# Altium project rev1-env.PrjPcb
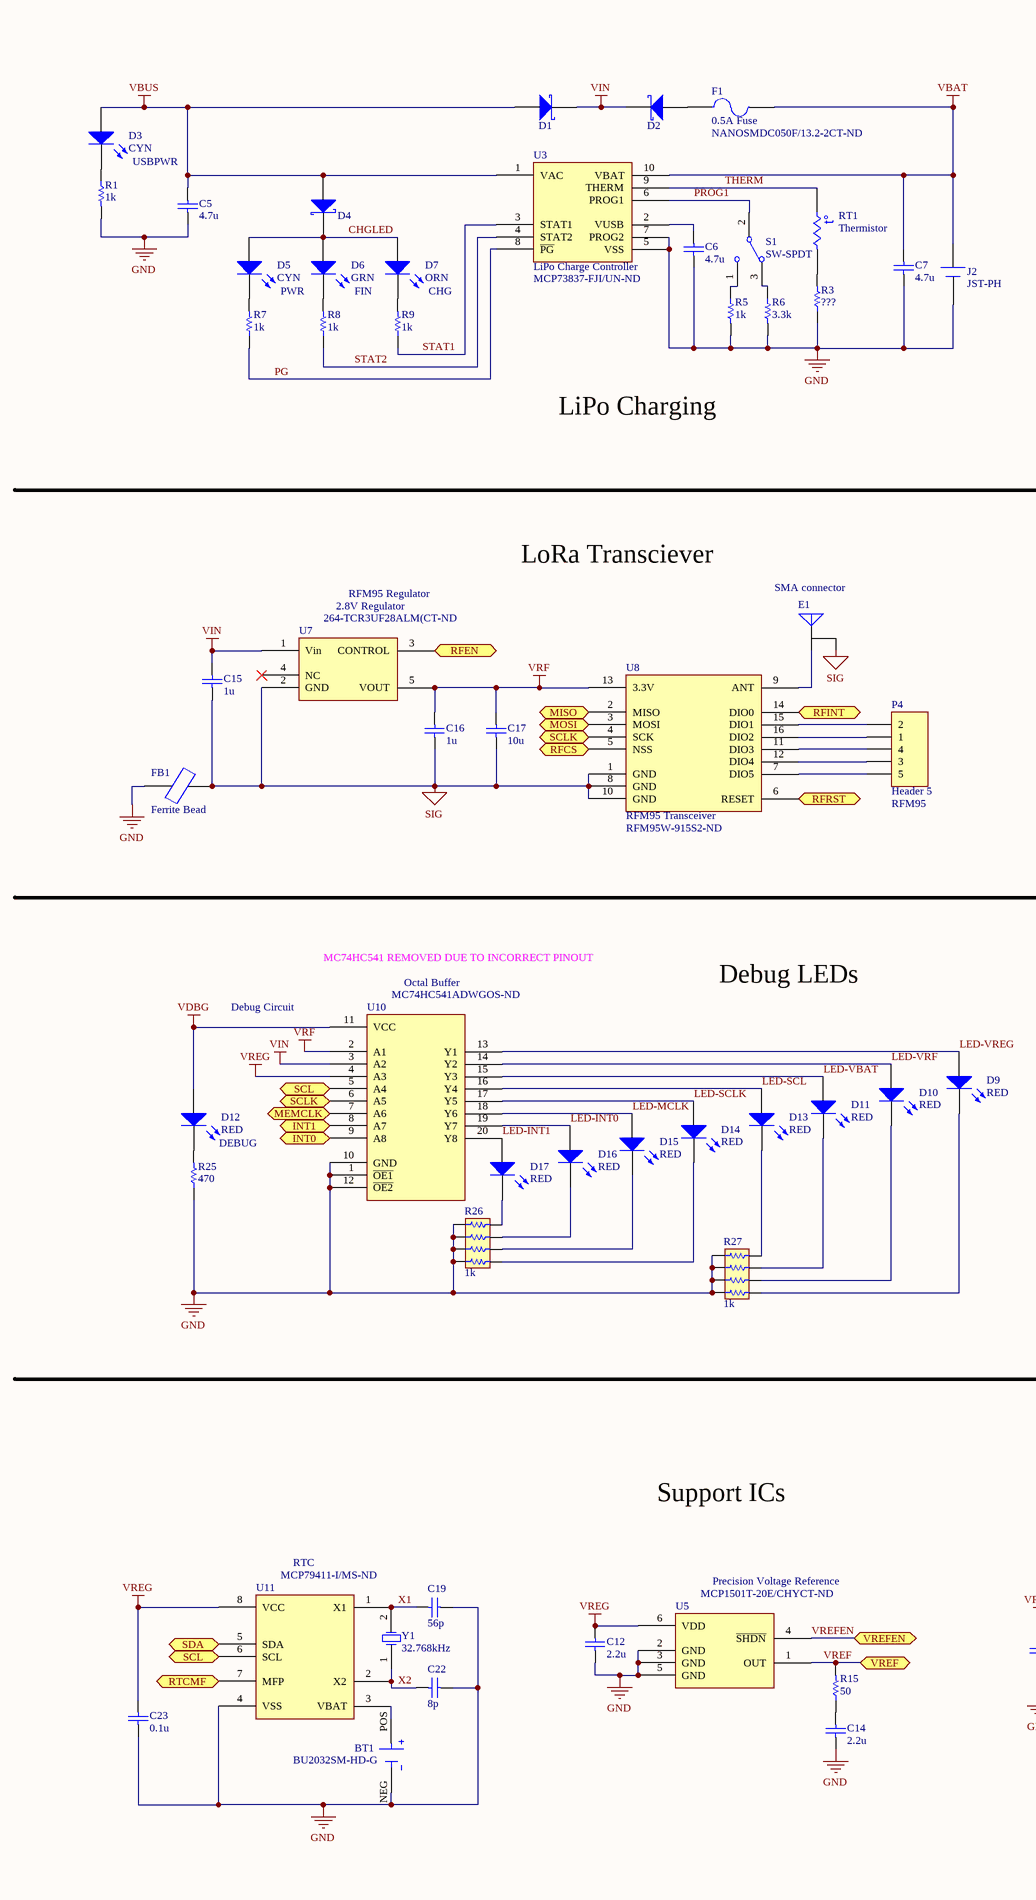
[diagram p0: sch-rev1-env.SchDoc, left]
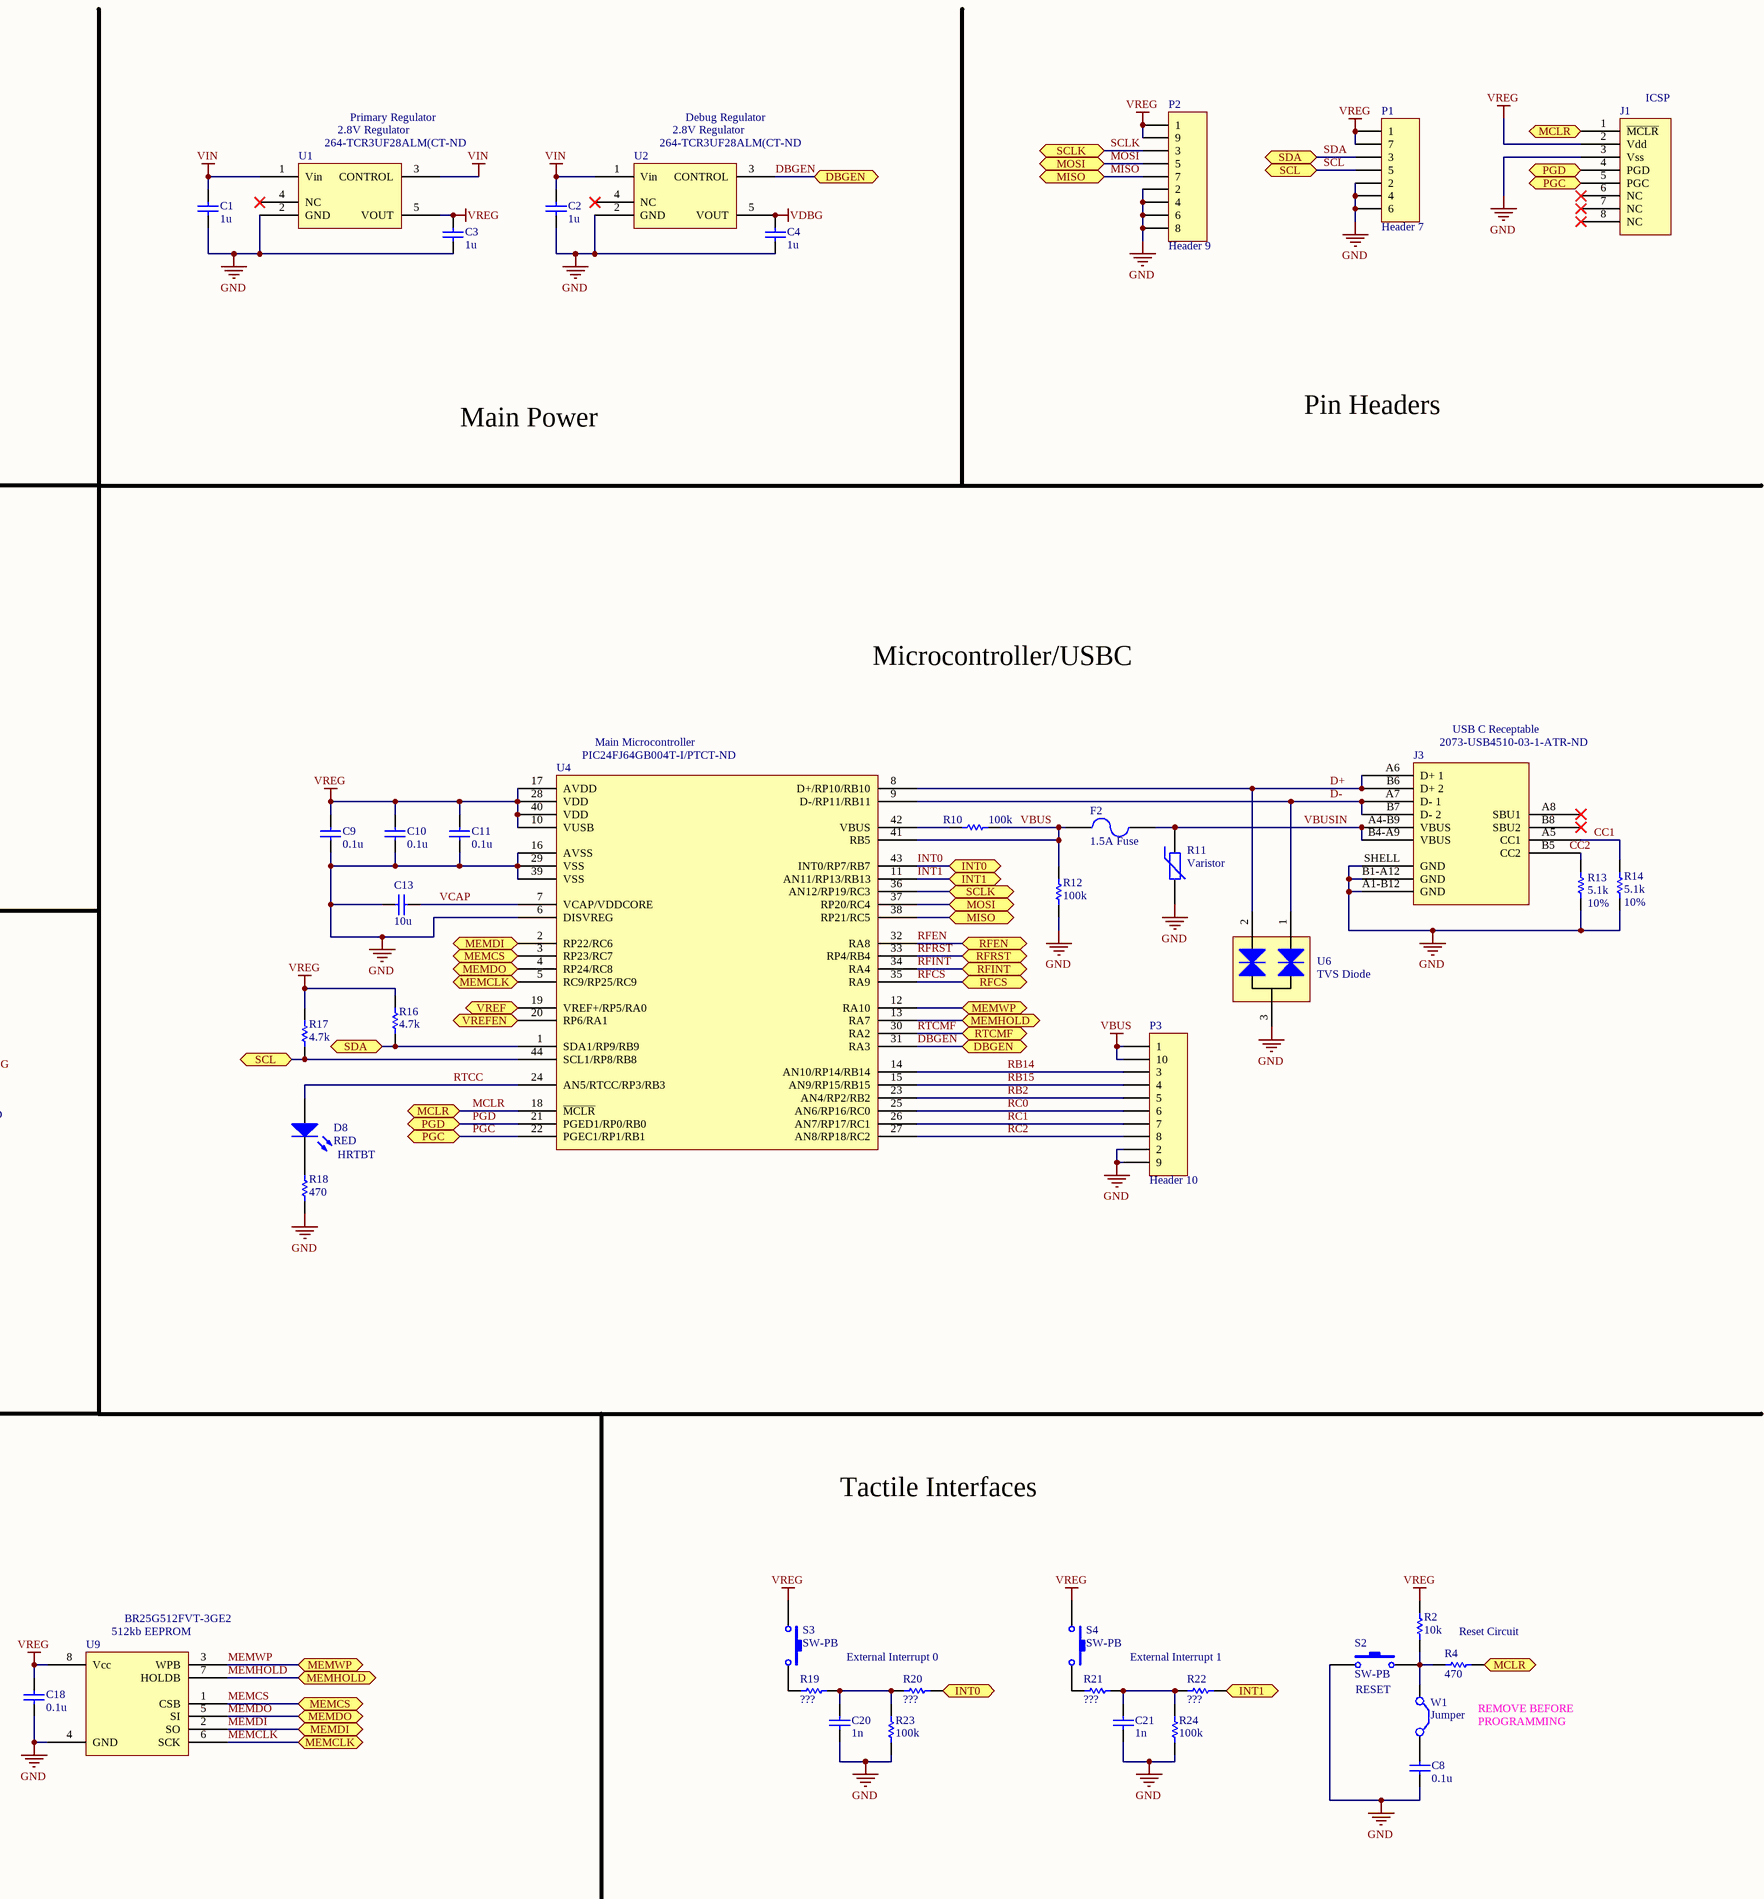
[diagram p1: sch-rev1-env.SchDoc, right]
4 sheets, 97 parts. Net scope: flat (ports and power ports of the same name join across sheets).
Board file: pcb-rev1-env.PcbDoc
Sheets:
  sch-rev1-env.SchDoc
  blockd2-rev1-env.SchDoc
  stated-rev1-env.SchDoc
  blockd-rev1-env.SchDoc

## Sheet sch-rev1-env.SchDoc: Sensor Backplane
size A2; Author: Edward Kneller; DrawnBy: Edward Kneller; Revision: rev01; SheetNumber: 1; SheetTotal: 4

### Parts
BT1  BU2032SM-HD-G  [BAT_BU2032SM-HD-G]
C1  value 1u  [0805]  (hidden comment: Cap)
C2  value 1u  [0805]  (hidden comment: Cap)
C3  value 1u  [0805]  (hidden comment: Cap)
C4  value 1u  [0805]  (hidden comment: Cap)
C5  value 4.7u  [0805]  (hidden comment: Cap)
C6  value 4.7u  [0805]  (hidden comment: Cap)
C7  value 4.7u  [0805]  (hidden comment: Cap)
C8  value 0.1u  [0805]  (hidden comment: Cap)
C9  value 0.1u  [0805]  (hidden comment: Cap)
C10  value 0.1u  [0805]  (hidden comment: Cap)
C11  value 0.1u  [0805]  (hidden comment: Cap)
C12  value 2.2u  [0805]  (hidden comment: Cap)
C13  value 10u  [0805]  (hidden comment: Cap)
C14  value 2.2u  [0805]  (hidden comment: Cap)
C15  value 1u  [0805]  (hidden comment: Cap)
C16  value 1u  [0805]  (hidden comment: Cap)
C17  value 10u  [0805]  (hidden comment: Cap)
C18  value 0.1u  [0805]  (hidden comment: Cap)
C19  value 56p  [0805]  (hidden comment: Cap)
C20  value 1n  [0805]  (hidden comment: Cap)
C21  value 1n  [0805]  (hidden comment: Cap)
C22  value 8p  [0805]  (hidden comment: Cap)
C23  value 0.1u  [0805]  (hidden comment: Cap)
D1  Schottky Diode  [DIODE SOD323]  (value not drawn)
D2  Schottky Diode  [DIODE SOD323]  (value not drawn)
D3  CYN  [LED PLCC2]
D4  Schottky Diode  [DIODE SOD323]  (value not drawn)
D5  CYN  [LED PLCC2]
D6  GRN  [LED PLCC2]
D7  ORN  [LED PLCC2]
D8  RED  [LED PLCC2]
D9  RED  [LED PLCC2]
D10  RED  [LED PLCC2]
D11  RED  [LED PLCC2]
D12  RED  [LED PLCC2]
D13  RED  [LED PLCC2]
D14  RED  [LED PLCC2]
D15  RED  [LED PLCC2]
D16  RED  [LED PLCC2]
D17  RED  [LED PLCC2]
E1  SMA connector  [SMA]
F1  0.5A Fuse  Supplier Part Number 1: NANOSMDC050F/13.2-2CT-ND  [1206]
F2  1.5A Fuse  [1206]
FB1  Ferrite Bead  [1206]
J1  ICSP  [HDR1X6]
J2  JST-PH  [JST-PH]
J3  USB C Receptable  Supplier Part Number 1: 2073-USB4510-03-1-ATR-ND  [USB4510-03-1-A]
P1  Header 7  [HDR1X7]
P2  Header 9  [HDR1X9]
P3  Header 10  [HDR1X10]
P4  Header 5  [HDR1X5]
R1  value 1k  [0805]  (hidden comment: Res1)
R2  value 10k  [0805]  (hidden comment: Res1)
R3  value ???  [0805]  (hidden comment: Res1)
R4  value 470  [0805]  (hidden comment: Res1)
R5  value 1k  [0805]  (hidden comment: Res1)
R6  value 3.3k  [0805]  (hidden comment: Res1)
R7  value 1k  [0805]  (hidden comment: Res1)
R8  value 1k  [0805]  (hidden comment: Res1)
R9  value 1k  [0805]  (hidden comment: Res1)
R10  value 100k  [0805]  (hidden comment: Res1)
R11  Varistor  [0603]
R12  value 100k  [0805]  (hidden comment: Res1)
R13  value 5.1k  Tolerance: 10%  [0805]  (hidden comment: Res1)
R14  value 5.1k  Tolerance: 10%  [0805]  (hidden comment: Res1)
R15  value 50  [0805]  (hidden comment: Res1)
R16  value 4.7k  [0805]  (hidden comment: Res1)
R17  value 4.7k  [0805]  (hidden comment: Res1)
R18  value 470  [0805]  (hidden comment: Res1)
R19  value ???  [0805]  (hidden comment: Res1)
R20  value ???  [0805]  (hidden comment: Res1)
R21  value ???  [0805]  (hidden comment: Res1)
R22  value ???  [0805]  (hidden comment: Res1)
R23  value 100k  [0805]  (hidden comment: Res1)
R24  value 100k  [0805]  (hidden comment: Res1)
R25  value 470  [0805]  (hidden comment: Res1)
R26  value 1k  [1206 ARRAY]  (hidden comment: Res1)
R27  value 1k  [1206 ARRAY]  (hidden comment: Res1)
RT1  Thermistor  [HDR1X2]
S1  SW-SPDT  [HDR1X3]
S2  SW-PB  [SM KT SWITCH]
S3  SW-PB  [SM KT SWITCH]
S4  SW-PB  [SM KT SWITCH]
U1  2.8V Regulator  Supplier Part Number 1: 264-TCR3UF28ALM(CT-ND  [REGULATOR SOT25(3?)]
U2  2.8V Regulator  Supplier Part Number 1: 264-TCR3UF28ALM(CT-ND  [REGULATOR SOT25(3?)]
U3  LiPo Charge Controller  Supplier Part Number 1: MCP73837-FJI/UN-ND  [LIPO MSOP]
U4  Main Microcontroller  Supplier Part Number 1: PIC24FJ64GB004T-I/PTCT-ND  [PIC24FJ64GB004T-I/PT]
U5  Precision Voltage Reference  Supplier Part Number 1: MCP1501T-20E/CHYCT-ND  [VREF SOT23-6]
U6  TVS Diode  [TVS SOT23-3]
U7  2.8V Regulator  Supplier Part Number 1: 264-TCR3UF28ALM(CT-ND  [REGULATOR SOT25(3?)]
U8  RFM95 Transceiver  Supplier Part Number 1: RFM95W-915S2-ND  [RFM95]
U9  512kb EEPROM  [EEPROM 8TSSOP]
U10  Octal Buffer  Supplier Part Number 1: MC74HC541ADWGOS-ND  [OCTAL BUFFER SOIC]
U11  RTC  Supplier Part Number 1: MCP79411-I/MS-ND  [RTC 8MSOP]
W1  Jumper  [HDR1X2]
Y1  32.768kHz  [CRYSTAL]

### Ports
DBGEN (bidir), INT0 (bidir), INT1 (bidir), MCLR (bidir), MEMCLK (bidir), MEMCS (bidir), MEMDI (bidir), MEMDO (bidir), MEMHOLD (bidir), MEMWP (bidir), MISO (bidir), MOSI (bidir), PGC (bidir), PGD (bidir), RFCS (bidir), RFEN (bidir), RFINT (bidir), RFRST (bidir), RTCMF (bidir), SCL (bidir), SCLK (bidir), SDA (bidir), VREF (bidir), VREFEN (bidir)

### Nets
GND: BT1.NEG C1.1 C2.1 C3.1 C4.1 C5.1 C6.1 C7.1 C8.1 C9.2 C10.2 C11.1 C12.2 C13.1 C14.2 C18.1 C19.1 C20.2 C21.2 C22.1 C23.1 FB1.1 J1.3(Vss) J2.2(-) J3.A1-B12(GND) J3.B1-A12(GND) J3.SHELL(GND) P1.2 P1.4 P1.6 P2.2 P2.4 P2.6 P2.8 P3.2 P3.9 R1.2 R3.1 R5.2 R6.2 R11.2 R12.2 R13.2 R14.1 R18.1 R23.2 R24.2 R25.1 R26.1 R26.2 R26.3 R26.4 R27.1 R27.2 R27.3 R27.4 S2.1-2 U1.2(GND) U2.2(GND) U3.5(VSS) U3.7(PROG2) U4.6(DISVREG) U4.16(AVSS) U4.29(VSS) U4.39(VSS) U5.2(GND) U5.3(GND) U5.5(GND) U6.3(GND) U9.4(GND) U10.1(~{OE1}) U10.10(GND) U10.12(~{OE2}) U11.4(VSS)
SIG: C15.1 C16.1 C17.1 E1.GND FB1.2 U7.2(GND) U8.1(GND) U8.8(GND) U8.10(GND)
VBAT: C7.2 F1.1 J2.1(+) U3.10(VBAT)
VBUS: C5.2 D1.2(A) D3.1(A) D4.2(A) F2.1 P3.1 P3.10 R10.2 R12.1 U3.1(VAC) U4.41(RB5)
VDBG: C4.2 D12.1(A) U2.5(VOUT) U10.11(VCC)
VIN: C1.2 C2.2 C15.2 D1.1(K) D2.1(K) U1.1(Vin) U1.3(CONTROL) U2.1(Vin) U7.1(Vin) U10.3(A2)
VREG: C3.2 C9.1 C10.1 C11.2 C12.1 C18.2 C23.2 J1.2(Vdd) P1.1 P1.7 P2.1 P2.9 R2.2 R16.1 R17.1 S3.1-2 S4.1-2 U1.5(VOUT) U4.10(VUSB) U4.17(AVDD) U4.28(VDD) U4.40(VDD) U5.6(VDD) U9.8(Vcc) U10.4(A3) U11.8(VCC)
VRF: C16.2 C17.2 U7.5(VOUT) U8.13(3.3V) U10.2(A1)
CC1: J3.A5(CC1) R14.2
CC2: J3.B5(CC2) R13.1
CHGLED: D4.1(K) D5.1(A) D6.1(A) D7.1(A)
D+: J3.A6(D+_1) J3.B6(D+_2) U4.8(D+/RP10/RB10) U6.2
D-: J3.A7(D-_1) J3.B7(D-_2) U4.9(D-/RP11/RB11) U6.1
DBGEN: U2.3(CONTROL) U4.31(RA3) ; port DBGEN
INT0: R20.2 U4.43(INT0/RP7/RB7) U10.9(A8) ; port INT0
INT1: R22.1 U4.11(AN11/RP13/RB13) U10.8(A7) ; port INT1
LED-INT0: D16.1(A) U10.19(Y7)
LED-INT1: D17.1(A) U10.20(Y8)
LED-MCLK: D15.1(A) U10.18(Y6)
LED-SCL: D13.1(A) U10.16(Y4)
LED-SCLK: D14.1(A) U10.17(Y5)
LED-VBAT: D11.1(A) U10.15(Y3)
LED-VREG: D9.1(A) U10.13(Y1)
LED-VRF: D10.1(A) U10.14(Y2)
MCLR: J1.1(~{MCLR}) R4.1 U4.18(~{MCLR}) ; port MCLR
MEMCLK: U4.5(RC9/RP25/RC9) U9.6(SCK) U10.7(A6) ; port MEMCLK
MEMCS: U4.3(RP23/RC7) U9.1(CSB) ; port MEMCS
MEMDI: U4.2(RP22/RC6) U9.2(SO) ; port MEMDI
MEMDO: U4.4(RP24/RC8) U9.5(SI) ; port MEMDO
MEMHOLD: U4.13(RA7) U9.7(HOLDB) ; port MEMHOLD
MEMWP: U4.12(RA10) U9.3(WPB) ; port MEMWP
MISO: P2.7 U4.38(RP21/RC5) U8.2(MISO) ; port MISO
MOSI: P2.5 U4.37(RP20/RC4) U8.3(MOSI) ; port MOSI
PG: R7.1 U3.8(~{PG})
PGC: J1.5(PGC) U4.22(PGEC1/RP1/RB1) ; port PGC
PGD: J1.4(PGD) U4.21(PGED1/RP0/RB0) ; port PGD
PROG1: S1.2 U3.6(PROG1)
RB2: P3.5 U4.23(AN4/RP2/RB2)
RB14: P3.3 U4.14(AN10/RP14/RB14)
RB15: P3.4 U4.15(AN9/RP15/RB15)
RC0: P3.6 U4.25(AN6/RP16/RC0)
RC1: P3.7 U4.26(AN7/RP17/RC1)
RC2: P3.8 U4.27(AN8/RP18/RC2)
RFCS: U4.35(RA9) U8.5(NSS) ; port RFCS
RFEN: U4.32(RA8) U7.3(CONTROL) ; port RFEN
RFINT: U4.34(RA4) U8.14(DIO0) ; port RFINT
RFRST: U4.33(RP4/RB4) U8.6(RESET) ; port RFRST
RTCC: D8.1(A) U4.24(AN5/RTCC/RP3/RB3)
RTCMF: U4.30(RA2) U11.7(MFP) ; port RTCMF
SCL: P1.5 R17.2 U4.44(SCL1/RP8/RB8) U10.5(A4) U11.6(SCL) ; port SCL
SCLK: P2.3 U4.36(AN12/RP19/RC3) U8.4(SCK) U10.6(A5) ; port SCLK
SDA: P1.3 R16.2 U4.1(SDA1/RP9/RB9) U11.5(SDA) ; port SDA
STAT1: R9.1 U3.3(STAT1)
STAT2: R8.1 U3.4(STAT2)
THERM: RT1.1 U3.9(THERM)
VBUSIN: F2.2 J3.A4-B9(VBUS) J3.B4-A9(VBUS) R11.1
VCAP: C13.2 U4.7(VCAP/VDDCORE)
VREF: R15.2 U4.19(VREF+/RP5/RA0) U5.1(OUT) ; port VREF
VREFEN: U4.20(RP6/RA1) U5.4(~{SHDN}) ; port VREFEN
X1: C19.2 U11.1(X1) Y1.2(OSC2)
X2: C22.2 U11.2(X2) Y1.1(OSC1)
NetBT1_POS: BT1.POS U11.3(VBAT)
NetC6_2: C6.2 U3.2(VUSB)
NetC8_2: C8.2 W1.2(C2)
NetC14_1: C14.1 R15.1
NetC20_1: C20.1 R19.1 R20.1 R23.1
NetC21_1: C21.1 R21.1 R22.2 R24.1
NetD2_2: D2.2(A) F1.2
NetD3_2: D3.2(K) R1.1
NetD5_2: D5.2(K) R7.2
NetD6_2: D6.2(K) R8.2
NetD7_2: D7.2(K) R9.2
NetD8_2: D8.2(K) R18.2
NetD9_2: D9.2(K) R27.8
NetD10_2: D10.2(K) R27.7
NetD11_2: D11.2(K) R27.6
NetD12_2: D12.2(K) R25.2
NetD13_2: D13.2(K) R27.5
NetD14_2: D14.2(K) R26.8
NetD15_2: D15.2(K) R26.7
NetD16_2: D16.2(K) R26.6
NetD17_2: D17.2(K) R26.5
NetE1_ANT: E1.ANT U8.9(ANT)
NetP4_1: P4.1 U8.16(DIO2)
NetP4_2: P4.2 U8.15(DIO1)
NetP4_3: P4.3 U8.12(DIO4)
NetP4_4: P4.4 U8.11(DIO3)
NetP4_5: P4.5 U8.7(DIO5)
NetR2_1: R2.1 R4.2 S2.3-4 W1.1(C1)
NetR3_2: R3.2 RT1.2
NetR5_1: R5.1 S1.1
NetR6_1: R6.1 S1.3
NetR10_1: R10.1 U4.42(VBUS)
NetR19_2: R19.2 S3.3-4
NetR21_2: R21.2 S4.3-4

Not connected (* = marked no-connect by the designer): J1 6(NC)* 7(NC)* 8(NC)*; J3 A8(SBU1)* B8(SBU2)*; U1 4(NC)*; U2 4(NC)*; U7 4(NC)*

### Notes on the sheet
- USBPWR
- Primary Regulator
- Debug Regulator
- PWR
- FIN
- CHG
- LiPo Charging
- Main Power
- Pin Headers
- RFM95 Regulator
- LoRa Transciever
- Microcontroller/USBC
- (near P4) RFM95
- MC74HC541 REMOVED DUE TO INCORRECT PINOUT
- Debug Circuit
- Debug LEDs
- DEBUG
- HRTBT
- Tactile Interfaces
- Support ICs
- Reset Circuit
- External Interrupt 0
- External Interrupt 1
- (near S2) RESET
- REMOVE BEFORE
- PROGRAMMING
- (in symbol Thermistor) t°

### Library data of the parts
BT1 = BU2032SM-HD-G: BATTERY HOLDER COIN 20MM SMD; MF: MPD _Memory; Package: None; MP: BU2032SM-HD-G; Value: *; Availability: Unavailable; Price: None; SnapEDA_Link: https://www.snapeda.com/parts/BU2032SM-HD-G/MPD%20%28Memory%20Protection%20Devices%29/view-part/4219667/?ref=snap; Supplier 1: Digi-Key; Supplier Part Number 1: 732-6718-1-ND
C1-C4 C15 C16 = cap 1u: Capacitor; Published: 8-Jun-2000; LatestRevisionDate: 17-Jul-2002; LatestRevisionNote: Re-released for DXP Platform.; PackageReference: RAD-0.3; Publisher: Altium Limited; PackageDescription: Radial Cap, Thru-Hole; 2 Leads; 0.3 in Pin Spacing; Supplier 1: Digi-Key; Supplier Part Number 1: 1276-1026-1-ND
C5-C7 = cap 4.7u: Capacitor; Published: 8-Jun-2000; LatestRevisionDate: 17-Jul-2002; LatestRevisionNote: Re-released for DXP Platform.; PackageReference: RAD-0.3; Publisher: Altium Limited; PackageDescription: Radial Cap, Thru-Hole; 2 Leads; 0.3 in Pin Spacing; Supplier 1: Digi-Key; Supplier Part Number 1: 1276-1259-1-ND
C8-C11 C18 C23 = cap 0.1u: Capacitor; Published: 8-Jun-2000; LatestRevisionDate: 17-Jul-2002; LatestRevisionNote: Re-released for DXP Platform.; PackageReference: RAD-0.3; Publisher: Altium Limited; PackageDescription: Radial Cap, Thru-Hole; 2 Leads; 0.3 in Pin Spacing; Supplier 1: Digi-Key; Supplier Part Number 1: 1276-1099-1-ND
C12 C14 = cap 2.2u: Capacitor; Published: 8-Jun-2000; LatestRevisionDate: 17-Jul-2002; LatestRevisionNote: Re-released for DXP Platform.; PackageReference: RAD-0.3; Publisher: Altium Limited; PackageDescription: Radial Cap, Thru-Hole; 2 Leads; 0.3 in Pin Spacing; Supplier 1: Digi-Key; Supplier Part Number 1: 1276-1763-1-ND
C13 C17 = cap 10u: Capacitor; Published: 8-Jun-2000; LatestRevisionDate: 17-Jul-2002; LatestRevisionNote: Re-released for DXP Platform.; PackageReference: RAD-0.3; Publisher: Altium Limited; PackageDescription: Radial Cap, Thru-Hole; 2 Leads; 0.3 in Pin Spacing; Supplier 1: Digi-Key; Supplier Part Number 1: 1276-1096-1-ND
C19 = cap 56p: Capacitor; Published: 8-Jun-2000; LatestRevisionDate: 17-Jul-2002; LatestRevisionNote: Re-released for DXP Platform.; PackageReference: RAD-0.3; Publisher: Altium Limited; PackageDescription: Radial Cap, Thru-Hole; 2 Leads; 0.3 in Pin Spacing; Supplier 1: Digi-Key; Supplier Part Number 1: 311-4179-1-ND
C20 C21 = cap 1n: Capacitor; Published: 8-Jun-2000; LatestRevisionDate: 17-Jul-2002; LatestRevisionNote: Re-released for DXP Platform.; PackageReference: RAD-0.3; Publisher: Altium Limited; PackageDescription: Radial Cap, Thru-Hole; 2 Leads; 0.3 in Pin Spacing; Supplier 1: Digi-Key; Supplier Part Number 1: 1276-1020-1-ND
C22 = cap 8p: Capacitor; Published: 8-Jun-2000; LatestRevisionDate: 17-Jul-2002; LatestRevisionNote: Re-released for DXP Platform.; PackageReference: RAD-0.3; Publisher: Altium Limited; PackageDescription: Radial Cap, Thru-Hole; 2 Leads; 0.3 in Pin Spacing; Supplier 1: Digi-Key; Supplier Part Number 1: 311-1097-1-ND
D1 D2 D4 = CUS08F30,H3F: Rectifier Diode Small Signal Schottky Si 0.8A 2-Pin USC T/R; Manufacturer: Toshiba; Average Rectified Current: 800mA; Max Repetitive Reverse Voltage (Vrrm): 30V; Element Configuration: Single; Peak Non-Repetitive Surge Current: 5A; Max Reverse Current: 50uA; Supplier 1: Digi-Key; Manufacturer Part Number: CUS08F30,H3F; RoHS: Yes; Category: Rectifier Diodes; Pricing 1: 1=0.35000, 10=0.28400, 100=0.15050, 500=0.09900, 1000=0.06732 (USD); Mount: Surface Mount; Case/Package: SOD; Number of Pins: 2; Contact Plating: Tin,Silver; Min Operating Temperature: -55°C; Max Operating Temperature: 125°C; Packaging: Tape and Reel; Max Reverse Voltage (DC): 30V; RoHS Compliant: Yes; ComponentLink1URL: http://toshiba.semicon-storage.com/info/docget.jsp?type=datasheet&lang=en&pid=CUS08F30&src-supplier=Avnet; ComponentLink1Description: http://toshiba.semicon-storage.com/info/docget.jsp?type=datasheet&lang=en&pid=CUS08F30&src-supplier=Avnet; ComponentLink2URL: http://toshiba.semicon-storage.com/info/lookup.jsp?pid=CUS08F30&amp;lang=en&src-supplier=Mouser; ComponentLink2Description: http://toshiba.semicon-storage.com/info/lookup.jsp?pid=CUS08F30&amp;lang=en&src-supplier=Mouser; ComponentLink3URL: https://toshiba.semicon-storage.com/info/docget.jsp?did=9019&prodName=CUS08F30&src-supplier=Digi-Key; ComponentLink3Description: https://toshiba.semicon-storage.com/info/docget.jsp?did=9019&prodName=CUS08F30&src-supplier=Digi-Key; Supplier Part Number 1: CUS08F30H3FCT-ND
D3 D5 = LED-CYAN: CYAN LED; Published: 8-Jun-2000; LatestRevisionDate: 08-Jul-2005; LatestRevisionNote: Mech Layer 1 removed.; PackageReference: LED-1; Publisher: Altium Limited; PackageDescription: LED; 2 Leads
D6 = LED-GREEN: Green LED; Published: 8-Jun-2000; LatestRevisionDate: 08-Jul-2005; LatestRevisionNote: Mech Layer 1 removed.; PackageReference: LED-1; Publisher: Altium Limited; PackageDescription: LED; 2 Leads
D7 = LED-ORANGE: Orange LED; Published: 8-Jun-2000; LatestRevisionDate: 08-Jul-2005; LatestRevisionNote: Mech Layer 1 removed.; PackageReference: LED-1; Publisher: Altium Limited; PackageDescription: LED; 2 Leads
D8-D17 = LED-RED: Red LED; Published: 8-Jun-2000; LatestRevisionDate: 08-Jul-2005; LatestRevisionNote: Mech Layer 1 removed.; PackageReference: LED-1; Publisher: Altium Limited; PackageDescription: LED; 2 Leads
E1 = SMA connector: Generic Antenna; Published: 24-Mar-1999; LatestRevisionDate: 17-Jul-2002; LatestRevisionNote: Re-released for DXP Platform.; PackageReference: PIN1; Publisher: Altium Limited
F1 = NANOSMDC050F/13.2-2: PTC Resettable Fuse 0.5A(hold) 1.1A(trip) 13.2VDC 100A 0.8W 0.1s 0.2Ohm SMD Solder Pad 1206 T/R Automotive; Manufacturer: Littelfuse; Hold Current: 500mA; Time to Trip: 100ms; Voltage Rating (DC): 13.2V; Approvals: UL,CSA,TUV; Supplier 1: Digi-Key; Manufacturer Part Number: NANOSMDC050F/13.2-2; RoHS: Yes; Category: PTC Resettable Fuses; Stock 1: 36978; Pricing 1: 1=0.46000, 5=0.44800, 10=0.43400, 50=0.36520, 100=0.30320, 250=0.27560, 500=0.23426, 1000=0.20670 (USD); Case Code (Imperial): 1206; Case Code (Metric): 3216; Min Operating Temperature: -40°C; Max Operating Temperature: 85°C; Max Current Rating: 100A; Trip Current: 1.1A; Packaging: Tape and Reel; Length: 3.4mm; REACH SVHC: Unknown; ComponentLink1URL: http://www.farnell.com/datasheets/2282569.pdf?src-supplier=Farnell; ComponentLink1Description: http://www.farnell.com/datasheets/2282569.pdf?src-supplier=Farnell; ComponentLink2URL: http://www.farnell.com/cad/1650136.pdf?src-supplier=Element14; ComponentLink2Description: http://www.farnell.com/cad/1650136.pdf?src-supplier=Element14; ComponentLink3URL: http://www.farnell.com/datasheets/1468628.pdf?src-supplier=Element14; ComponentLink3Description: http://www.farnell.com/datasheets/1468628.pdf?src-supplier=Element14; ComponentLink4URL: http://www.farnell.com/datasheets/2282569.pdf?src-supplier=Newark; ComponentLink4Description: http://www.farnell.com/datasheets/2282569.pdf?src-supplier=Newark; ComponentLink5URL: http://www.littelfuse.com/~/media/electronics/datasheets/resettable_ptcs/littelfuse_ptc_nanosmd_catalog_datasheet.pdf.pdf?src-supplier=Digi-Key; ComponentLink5Description: http://www.littelfuse.com/~/media/electronics/datasheets/resettable_ptcs/littelfuse_ptc_nanosmd_catalog_datasheet.pdf.pdf?src-supplier=Digi-Key; ComponentLink6URL: https://www.littelfuse.com/~/media/electronics/product_specifications/resettable_ptcs/littelfuse_ptc_nanosmdc050f_13_2_2_product_specification.pdf.pdf?src-supplier=Digi-Key; ComponentLink6Description: https://www.littelfuse.com/~/media/electronics/product_specifications/resettable_ptcs/littelfuse_ptc_nanosmdc050f_13_2_2_product_specification.pdf.pdf?src-supplier=Digi-Key
F2 = NANOSMDC150F-2: PTC Resettable Fuse 1.5A(hold) 3A(trip) 6VDC 100A 0.8W 0.3s 0.04Ohm SMD Solder Pad 1206 T/R; Manufacturer: Littelfuse; Voltage Rating (DC): 6V; Supplier 1: Digi-Key; Manufacturer Part Number: NANOSMDC150F-2; RoHS: Yes; Category: PTC Resettable Fuses; Stock 1: 5334; Pricing 1: 1=0.46000, 5=0.44800, 10=0.43400, 50=0.36520, 100=0.30320, 250=0.27560, 500=0.23426, 1000=0.20670 (USD); Min Operating Temperature: -40°C; Max Operating Temperature: 85°C; Hold Current: 1.5A; RoHS Compliant: Yes; REACH SVHC: Unknown; ComponentLink1URL: http://www.farnell.com/datasheets/2282569.pdf?src-supplier=Farnell; ComponentLink1Description: http://www.farnell.com/datasheets/2282569.pdf?src-supplier=Farnell; ComponentLink2URL: http://www.farnell.com/cad/1650137.pdf?src-supplier=Element14; ComponentLink2Description: http://www.farnell.com/cad/1650137.pdf?src-supplier=Element14; ComponentLink3URL: http://www.farnell.com/datasheets/1468628.pdf?src-supplier=Element14; ComponentLink3Description: http://www.farnell.com/datasheets/1468628.pdf?src-supplier=Element14; ComponentLink4URL: http://www.farnell.com/datasheets/2282569.pdf?src-supplier=Newark; ComponentLink4Description: http://www.farnell.com/datasheets/2282569.pdf?src-supplier=Newark; ComponentLink5URL: https://www.littelfuse.com/~/media/electronics/product_specifications/resettable_ptcs/littelfuse_ptc_nanosmdc150f_2_product_specification.pdf.pdf?src-supplier=Digi-Key; ComponentLink5Description: https://www.littelfuse.com/~/media/electronics/product_specifications/resettable_ptcs/littelfuse_ptc_nanosmdc150f_2_product_specification.pdf.pdf?src-supplier=Digi-Key; ComponentLink6URL: http://www.littelfuse.com/~/media/electronics/datasheets/resettable_ptcs/littelfuse_ptc_nanosmd_catalog_datasheet.pdf.pdf?src-supplier=Digi-Key; ComponentLink6Description: http://www.littelfuse.com/~/media/electronics/datasheets/resettable_ptcs/littelfuse_ptc_nanosmd_catalog_datasheet.pdf.pdf?src-supplier=Digi-Key; Supplier Part Number 1: NANOSMDC150F-2CT-ND
J1 = ICSP header
J2 = JST-PH: Input/Output
J3 = USB4510-03-1-A: USB Type C Receptacle for USB 2.0, SMT Type Mid Mount, 1.6mm Offset; Manufacturer: Global Connector Technology; Supplier 1: Digi-Key; Manufacturer Part Number: USB4510-03-1-A; RoHS: No; Category: Uncategorized
P1 = Header 7: Header, 7-Pin; LatestRevisionDate: 17-Jul-2002; LatestRevisionNote: Re-released for DXP Platform.; Publisher: Altium Limited
P2 = Header 9: Header, 9-Pin; LatestRevisionDate: 17-Jul-2002; LatestRevisionNote: Re-released for DXP Platform.; Publisher: Altium Limited
P3 = Header 10: Header, 10-Pin; LatestRevisionDate: 17-Jul-2002; LatestRevisionNote: Re-released for DXP Platform.; Publisher: Altium Limited
P4 = Header 5: Header, 5-Pin; LatestRevisionDate: 17-Jul-2002; LatestRevisionNote: Re-released for DXP Platform.; Publisher: Altium Limited
R1 R5 R7-R9 = resistor 1k: Resistor; Published: 8-Jun-2000; LatestRevisionDate: 17-Jul-2002; LatestRevisionNote: Re-released for DXP Platform.; PackageReference: AXIAL-0.3; Publisher: Altium Limited; PackageDescription: Axial Device, Thru-Hole; 2 Leads; 0.3 in Pin Spacing
R2 = resistor 10k: Resistor; Published: 8-Jun-2000; LatestRevisionDate: 17-Jul-2002; LatestRevisionNote: Re-released for DXP Platform.; PackageReference: AXIAL-0.3; Publisher: Altium Limited; PackageDescription: Axial Device, Thru-Hole; 2 Leads; 0.3 in Pin Spacing
R3 R19-R22 = resistor ???: Resistor; Published: 8-Jun-2000; LatestRevisionDate: 17-Jul-2002; LatestRevisionNote: Re-released for DXP Platform.; PackageReference: AXIAL-0.3; Publisher: Altium Limited; PackageDescription: Axial Device, Thru-Hole; 2 Leads; 0.3 in Pin Spacing
R4 R18 R25 = resistor 470: Resistor; Published: 8-Jun-2000; LatestRevisionDate: 17-Jul-2002; LatestRevisionNote: Re-released for DXP Platform.; PackageReference: AXIAL-0.3; Publisher: Altium Limited; PackageDescription: Axial Device, Thru-Hole; 2 Leads; 0.3 in Pin Spacing
R6 = resistor 3.3k: Resistor; Published: 8-Jun-2000; LatestRevisionDate: 17-Jul-2002; LatestRevisionNote: Re-released for DXP Platform.; PackageReference: AXIAL-0.3; Publisher: Altium Limited; PackageDescription: Axial Device, Thru-Hole; 2 Leads; 0.3 in Pin Spacing
R10 R12 R23 R24 = resistor 100k: Resistor; Published: 8-Jun-2000; LatestRevisionDate: 17-Jul-2002; LatestRevisionNote: Re-released for DXP Platform.; PackageReference: AXIAL-0.3; Publisher: Altium Limited; PackageDescription: Axial Device, Thru-Hole; 2 Leads; 0.3 in Pin Spacing
R11 = CG0603MLA-5.5ME: Var MOV 4VAC/5.5VDC 30A 9.6V 0603 SMD Paper T/R; Manufacturer: Bourns; Capacitance: 270pF; Max Voltage Rating (AC): 4V; Max Voltage Rating (DC): 5.5V; Clamping Current: 1A; Tolerance: 20%; Number of Circuits: 1; Energy: 0.1J; Clamping Voltage: 19V; Min Varistor Voltage: 6.4V; Supplier 1: Digi-Key; Manufacturer Part Number: CG0603MLA-5.5ME; RoHS: Yes; Category: Varistors; Stock 1: 111737; Pricing 1: 1=0.26000, 10=0.23800, 25=0.17120, 100=0.13300, 250=0.08360, 500=0.07124, 1000=0.04845 (USD); Mount: Surface Mount; Case/Package: 0603; Case Code (Metric): 1608; Case Code (Imperial): 0603; Contact Plating: Nickel; Size Code: 0603; Min Operating Temperature: -55°C; Max Operating Temperature: 125°C; Package Quantity: 4000; Packaging: Tape and Reel; Varistor Voltage: 9.6V; Series: MLA; Max Surge Current: 30A; Voltage Rating (DC): 5.5V; Voltage Rating (AC): 4V; Operating Supply Voltage: 5.5V; Current Rating: 30A; Number of Channels: 1; Termination: SMD/SMT; Voltage: 5.5V; Voltage Tolerance: 20%; Max Varistor Voltage: 9.6V; Peak Pulse Current: 30A; Length: 1mm; Width: 0.8mm; Depth: 0.8mm; Radiation Hardening: No; REACH SVHC: No SVHC; RoHS Compliant: Yes; ComponentLink1URL: https://datasheet.ciiva.com/3023/mla-3023927.pdf?src-supplier=Avnet; ComponentLink1Description: https://datasheet.ciiva.com/3023/mla-3023927.pdf?src-supplier=Avnet; ComponentLink2URL: https://datasheet.ciiva.com/3023/mla-3023928.pdf?src-supplier=Avnet; ComponentLink2Description: https://datasheet.ciiva.com/3023/mla-3023928.pdf?src-supplier=Avnet; ComponentLink3URL: https://datasheet.ciiva.com/1283/1695374-1283138.pdf?src-supplier=Farnell; ComponentLink3Description: https://datasheet.ciiva.com/1283/1695374-1283138.pdf?src-supplier=Farnell; ComponentLink4URL: https://datasheet.ciiva.com/6992/mla-6992302.pdf?src-supplier=Digi-Key; ComponentLink4Description: https://datasheet.ciiva.com/6992/mla-6992302.pdf?src-supplier=Digi-Key; ComponentLink5URL: https://datasheet.ciiva.com/16957/mla-16957366.pdf?src-supplier=Avnet+Europe; ComponentLink5Description: https://datasheet.ciiva.com/16957/mla-16957366.pdf?src-supplier=Avnet+Europe; ComponentLink6URL: https://datasheet.ciiva.com/26819/getdatasheetpartid-171411-26819835.pdf?src-supplier=Verical; ComponentLink6Description: https://datasheet.ciiva.com/26819/getdatasheetpartid-171411-26819835.pdf?src-supplier=Verical; Supplier Part Number 1: CG0603MLA-5.5MECT-ND
R13 R14 = resistor 5.1k: Resistor; Published: 8-Jun-2000; LatestRevisionDate: 17-Jul-2002; LatestRevisionNote: Re-released for DXP Platform.; PackageReference: AXIAL-0.3; Publisher: Altium Limited; PackageDescription: Axial Device, Thru-Hole; 2 Leads; 0.3 in Pin Spacing
R15 = resistor 50: Resistor; Published: 8-Jun-2000; LatestRevisionDate: 17-Jul-2002; LatestRevisionNote: Re-released for DXP Platform.; PackageReference: AXIAL-0.3; Publisher: Altium Limited; PackageDescription: Axial Device, Thru-Hole; 2 Leads; 0.3 in Pin Spacing
R16 R17 = resistor 4.7k: Resistor; Published: 8-Jun-2000; LatestRevisionDate: 17-Jul-2002; LatestRevisionNote: Re-released for DXP Platform.; PackageReference: AXIAL-0.3; Publisher: Altium Limited; PackageDescription: Axial Device, Thru-Hole; 2 Leads; 0.3 in Pin Spacing
R26 R27 = resarray: Resistor; Published: 8-Jun-2000; LatestRevisionDate: 17-Jul-2002; LatestRevisionNote: Re-released for DXP Platform.; PackageReference: AXIAL-0.3; Publisher: Altium Limited; PackageDescription: Axial Device, Thru-Hole; 2 Leads; 0.3 in Pin Spacing
S1 = SW-SPDT: SPDT Subminiature Toggle Switch, Right Angle Mounting, Vertical Actuation; Published: 24-Mar-1999; LatestRevisionDate: 17-Dec-2003; LatestRevisionNote: Schematic revised, PCB Footprint replaced.; DatasheetVersion: 05-Dec-2000; PackageReference: TL36WW15050; Publisher: Altium Limited; PackageDescription: Switch; 4 Leads; ComponentLink1Description: Manufacturer Link; ComponentLink1URL: http://www.apem.com
S2-S4 = SW-PB: Switch; Published: 24-Mar-1999; LatestRevisionDate: 17-Jul-2002; LatestRevisionNote: Re-released for DXP Platform.; PackageReference: SPST-2; Publisher: Altium Limited; PackageDescription: Switch; 2 Leads; Supplier 1: Digi-Key; Supplier Part Number 1: CKN1838CT-ND
U1 U2 U7 = TCR3UF28A,LM(CT: LDO Regulator Positive 2.8V 300mA 5-Pin SOT-25; Manufacturer: Toshiba; Supplier 1: Digi-Key; Manufacturer Part Number: TCR3UF28A,LM(CT; RoHS: No; Stock 1: 5963; Pricing 1: 1=0.42000, 10=0.34400, 25=0.31440, 100=0.23400, 250=0.21212, 500=0.17554, 1000=0.13165 (USD)
U3 = MCP73837-FJI/UN: Battery Charge Controller Li-Ion/Li-Pol 1200mA 4.2V/4.35V/4.4V/4.5V 10-Pin MSOP Tube; Manufacturer: Microchip; Output Voltage: 4.5V; Output Current: 1.2A; Min Supply Voltage: 3.75V; Max Supply Voltage: 6V; Max Output Current: 100mA; Max Output Voltage: 4.523V; Min Output Voltage: 4.179V; Supplier 1: Digi-Key; Manufacturer Part Number: MCP73837-FJI/UN; RoHS: Yes; Category: Battery Management; Stock 1: 439; Pricing 1: 1=1.38000, 25=1.14480, 100=1.03880 (USD); Mount: Surface Mount; Case/Package: MSOP; Number of Pins: 10; Min Operating Temperature: -40°C; Max Operating Temperature: 85°C; Package Quantity: 100; Packaging: Rail/Tube; Length: 3mm; Width: 4.9mm; Height: 1.1mm; Radiation Hardening: No; RoHS Compliant: Yes; ComponentLink1URL: https://datasheet.ciiva.com/15115/getdatasheetpartid-786979-15115388.pdf?src-supplier=Verical; ComponentLink1Description: https://datasheet.ciiva.com/15115/getdatasheetpartid-786979-15115388.pdf?src-supplier=Verical; ComponentLink2URL: https://datasheet.ciiva.com/1933/22071b-1933528.pdf?src-supplier=Digi-Key; ComponentLink2Description: https://datasheet.ciiva.com/1933/22071b-1933528.pdf?src-supplier=Digi-Key
U4 = PIC24FJ64GB004T-I/PT: 16-bit MCU/DSC, 64 KB, 8192 Bytes, 32 MHz, 2 to 3.6V, TQFP-44, RoHS; Manufacturer: Microchip; Min Supply Voltage: 2V; Number of I/Os: 33; Interface: I2C,SPI,IrDA,UART,USB,USART; RAM Size: 8KB; Number of Timers/Counters: 5; Frequency: 32MHz; Data Bus Width: 16b; Memory Type: FLASH; Memory Size: 64KB; Core Architecture: PIC; Oscillator Type: Internal; Watchdog Timer: Yes; Peripherals: Brown-out Detect/Reset,POR,PWM,WDT; Supplier 1: Digi-Key; Manufacturer Part Number: PIC24FJ64GB004T-I/PT; RoHS: Yes; Category: Microcontrollers; Stock 1: 2389; Pricing 1: 1=5.00000, 25=4.57720, 100=4.15150 (USD); Mount: Surface Mount; Case/Package: TQFP; Number of Pins: 44; Min Operating Temperature: -40°C; Max Operating Temperature: 85°C; Max Supply Voltage: 3.6V; Packaging: Tape and Reel; Package Quantity: 1200; Number of Programmable I/O: 33; Max Frequency: 32MHz; Series: PIC® XLP™ 24F; Radiation Hardening: No; RoHS Compliant: Yes; Lead Free: Lead Free; ComponentLink1URL: https://datasheet.ciiva.com/1576/39940d-1576971.pdf?src-supplier=Digi-Key; ComponentLink1Description: https://datasheet.ciiva.com/1576/39940d-1576971.pdf?src-supplier=Digi-Key
U5 = MCP1501T-20E/CHY: V-Ref Precision 2.048V 20mA 6-Pin SOT-23 T/R; Manufacturer: Microchip; Temperature Coefficient: 50ppm/°C; Operating Supply Current: 550uA; Tolerance: 0.1%; Reference Type: Series; Output Type: Fixed; Supplier 1: Digi-Key; Manufacturer Part Number: MCP1501T-20E/CHY; RoHS: Yes; Category: Voltage References; Stock 1: 29051; Pricing 1: 1=0.91000, 25=0.75280, 100=0.70500 (USD); Mount: Surface Mount; Case/Package: SOT-23-6; Min Operating Temperature: -40°C; Max Operating Temperature: 125°C; Packaging: Tape and Reel; Min Output Voltage: 2.048V; Output Current: 20mA; RoHS Compliant: Yes; ComponentLink1URL: http://www.farnell.com/datasheets/2595665.pdf?src-supplier=Farnell; ComponentLink1Description: http://www.farnell.com/datasheets/2595665.pdf?src-supplier=Farnell; ComponentLink2URL: http://www.microchip.com/mymicrochip/filehandler.aspx?ddocname=en584595&src-supplier=Digi-Key; ComponentLink2Description: http://www.microchip.com/mymicrochip/filehandler.aspx?ddocname=en584595&src-supplier=Digi-Key
U6 = DF3D18FU,LF: ESD Suppressor Diode TVS Bi-Dir 12V Automotive 3-Pin USM T/R; Manufacturer: Toshiba; Number of Bidirectional Channels: 2; Min Breakdown Voltage: 16.2V; Clamping Voltage: 33V; Peak Pulse Power: 80W; Power Line Protection: No; Peak Pulse Current: 2.5A; Supplier 1: Digi-Key; Manufacturer Part Number: DF3D18FU,LF; RoHS: Yes; Category: TVS Diodes; Stock 1: 11057; Pricing 1: 1=0.42000, 10=0.34100, 100=0.23230, 500=0.17424, 1000=0.13068 (USD); Mount: Surface Mount; Packaging: Tape and Reel; Reverse Standoff Voltage: 12V; ComponentLink1URL: http://toshiba.semicon-storage.com/info/docget.jsp?did=29958&prodName=DF3D18FU&src-supplier=Digi-Key; ComponentLink1Description: http://toshiba.semicon-storage.com/info/docget.jsp?did=29958&prodName=DF3D18FU&src-supplier=Digi-Key; Supplier Part Number 1: DF3D18FULFCT-ND
U8 = RFM95W-915S2: Rx Txrx Module Ism < 1GHZ SMD; Manufacturer: RF Solutions; Interface: SPI; Current - Receiving: 12.1mA; Current - Transmitting: 120mA; Frequency: 915MHz; Data Rate: 300Kbps; Sensitivity: -148dBm; Supplier 1: Digi-Key; Manufacturer Part Number: RFM95W-915S2; RoHS: No; Category: RF Receivers, Transceivers; Stock 1: 355; Pricing 1: 1=13.44000 (USD); Mount: Surface Mount; Case/Package: SMD/SMT; Min Operating Temperature: -20°C; Max Operating Temperature: 70°C; Packaging: Bulk; ComponentLink1URL: https://datasheet.ciiva.com/67679/1463993415rfm95-96-97-98w-67679566.pdf?src-supplier=Digi-Key; ComponentLink1Description: https://datasheet.ciiva.com/67679/1463993415rfm95-96-97-98w-67679566.pdf?src-supplier=Digi-Key
U9 = BR25G512FVT-3GE2: EEPROM Serial-SPI 512K-bit 64K x 8 2.5V/3.3V/5V 8-Pin TSSOP-B T/R; Manufacturer: Rohm; Supplier 1: Digi-Key; RoHS: Yes; Category: EEPROM; Stock 1: 376; Pricing 1: 1=0.89000, 10=0.81000, 25=0.79960, 50=0.79500, 100=0.71080, 250=0.70480, 500=0.69438, 1000=0.66954 (USD); RoHS Compliant: Yes; Supplier Part Number 1: BR25G512FVT-3GE2CT-ND; Manufacturer Part Number: BR25G512FVT-3GE2
U10 = MC74HC541ADWG: MC74HC541ADWG Octal Buffer & Line Driver; 3-State; 2 - 6 V; 20-Pin SOIC; Manufacturer: ON Semiconductor; Propagation Delay: 165ns; Min Supply Voltage: 2V; Max Supply Voltage: 6V; Logic Function: Buffer,Inverting,Receiver; Number of Elements: 1; Number of Channels: 8; Max Power Dissipation: 500mW; High Level Output Current: -7.8mA; Low Level Output Current: 7.8mA; Number of Output Lines: 3; Polarity: Non-Inverting; Quiescent Current: 4uA; Turn-On Delay Time: 80ns; Current Rating: 54A; Supplier 1: Digi-Key; Manufacturer Part Number: MC74HC541ADWG; RoHS: Yes; Category: Amplifiers - Op Amps, Buffer, Instrumentation; Stock 1: 434; Pricing 1: 1=0.83000, 10=0.72800, 25=0.68360, 100=0.55780, 250=0.51812, 500=0.44096, 1000=0.36400 (USD); Mount: Surface Mount; Case/Package: SOIC; Number of Pins: 20; Min Operating Temperature: -55°C; Max Operating Temperature: 125°C; Packaging: Rail/Tube; Number of Inputs: 8; Number of Outputs: 8; Package Quantity: 38; Number of Bits per Element: 8; Number of Input Lines: 8; Number of Bits: 8; Output Type: 3-STATE; Series: 74HC; Technology: CMOS; Number of Functions: 3; Supply Voltage-Nom: 6V; Length: 12.95mm; Width: 7.6mm; Height: 2.4mm; Radiation Hardening: No; REACH SVHC: No SVHC; Lead Free: Lead Free; Halogen Free: Halogen Free; RoHS Compliant: Yes; ComponentLink1URL: https://datasheet.ciiva.com/15094/getdatasheetpartid-72100-15094514.pdf?src-supplier=Verical; ComponentLink1Description: https://datasheet.ciiva.com/15094/getdatasheetpartid-72100-15094514.pdf?src-supplier=Verical; ComponentLink2URL: https://datasheet.ciiva.com/19477/796301-19477328.pdf?src-supplier=Jameco; ComponentLink2Description: https://datasheet.ciiva.com/19477/796301-19477328.pdf?src-supplier=Jameco; ComponentLink3URL: https://datasheet.ciiva.com/1835/mc74hc541a-d-1835370.pdf?src-supplier=Digi-Key; ComponentLink3Description: https://datasheet.ciiva.com/1835/mc74hc541a-d-1835370.pdf?src-supplier=Digi-Key; ComponentLink4URL: https://datasheet.ciiva.com/16395/mc74hc541a-d-16395608.pdf?src-supplier=Future+Electronics; ComponentLink4Description: https://datasheet.ciiva.com/16395/mc74hc541a-d-16395608.pdf?src-supplier=Future+Electronics; ComponentLink5URL: https://datasheet.ciiva.com/7970/mc74hc541a-d-7970901.pdf?src-supplier=Element14; ComponentLink5Description: https://datasheet.ciiva.com/7970/mc74hc541a-d-7970901.pdf?src-supplier=Element14
U11 = MCP79411-I/MS: Real Time Clock Serial 64byte Clock/Calendar/Alarm/Battery Backup Automotive 8-Pin MSOP Tube; Manufacturer: Microchip; Time Format: HH:MM:SS; Max Supply Voltage: 5.5V; Min Supply Voltage: 1.8V; Memory Size: 64B; Supplier 1: Digi-Key; Manufacturer Part Number: MCP79411-I/MS; RoHS: Yes; Category: Real Time Clocks; Stock 1: 16; Pricing 1: 1=1.08000, 25=1.06480 (USD); Mount: Surface Mount; Case/Package: MSOP; Number of Pins: 8; Min Operating Temperature: -40°C; Max Operating Temperature: 85°C; Logic Function: Clock; Packaging: Rail/Tube; Package Quantity: 100; Length: 3mm; Width: 3mm; Height: 0.95mm; Radiation Hardening: No; Lead Free: Lead Free; RoHS Compliant: Yes; ComponentLink1URL: https://datasheet.ciiva.com/8145/22266b-8145527.pdf?src-supplier=Avnet; ComponentLink1Description: https://datasheet.ciiva.com/8145/22266b-8145527.pdf?src-supplier=Avnet; ComponentLink2URL: https://datasheet.ciiva.com/6667/22266d-6667784.pdf?src-supplier=Digi-Key; ComponentLink2Description: https://datasheet.ciiva.com/6667/22266d-6667784.pdf?src-supplier=Digi-Key; ComponentLink3URL: https://datasheet.ciiva.com/17307/22266b-17307013.pdf?src-supplier=Avnet+Europe; ComponentLink3Description: https://datasheet.ciiva.com/17307/22266b-17307013.pdf?src-supplier=Avnet+Europe; ComponentLink4URL: https://datasheet.ciiva.com/15152/getdatasheetpartid-765496-15152886.pdf?src-supplier=Verical; ComponentLink4Description: https://datasheet.ciiva.com/15152/getdatasheetpartid-765496-15152886.pdf?src-supplier=Verical
W1 = Jumper: 2 pin jumper; Published: 24-Mar-1999; LatestRevisionDate: 17-Jul-2002; LatestRevisionNote: Re-released for DXP Platform.; PackageReference: RAD-0.2; Publisher: Altium Limited; PackageDescription: Radial Cap, Thru-Hole; 2 Leads; 0.2 in Pin Spacing
Y1 = ECS-.327-7-12-C-TR: Crystal 0.032768MHz ±10ppm (Tol) 7pF Flexural 90000Ohm Automotive 2-Pin Ultra Mini-CSMD T/R; Manufacturer: ECS International; ESR (Equivalent Series Resistance): 90kR; Supplier 1: Digi-Key; Manufacturer Part Number: ECS-.327-7-12-C-TR; RoHS: Yes; Category: Crystals and Oscillators; Stock 1: 48281; Pricing 1: 1=0.89000, 10=0.78400, 50=0.73320, 100=0.64790, 500=0.61380, 1000=0.51150 (USD); Mount: Surface Mount; Case/Package: SMD/SMT; Min Operating Temperature: -40°C; Max Operating Temperature: 85°C; Packaging: Tape and Reel; Frequency: 32.768kHz; Frequency Tolerance: 10ppm; Load Capacitance: 7pF; RoHS Compliant: Yes; ComponentLink1URL: https://www.ecsxtal.com/store/pdf/ECX_12.pdf?src-supplier=Digi-Key; ComponentLink1Description: https://www.ecsxtal.com/store/pdf/ECX_12.pdf?src-supplier=Digi-Key; Supplier Part Number 1: XC2290CT-ND
FB1 = ferrite bead: Supplier 1: Digi-Key; Supplier Part Number 1: 732-6718-1-ND
RT1 = Thermistor: Published: 24-Mar-1999; LatestRevisionDate: 29-May-2009; LatestRevisionNote: IPC-7351 Footprint Added.; PackageVersion: Mar-2003; PackageReference: 6-0805; Publisher: Altium Limited; PackageDescription: Chip Resistor 0805 Case Size; Code_IPC: RESC2012

## Sheet blockd2-rev1-env.SchDoc: Block Diagram
size A4; Date: 02/24/22; Author: Edward Kneller; SheetNumber: 2; SheetTotal: 4
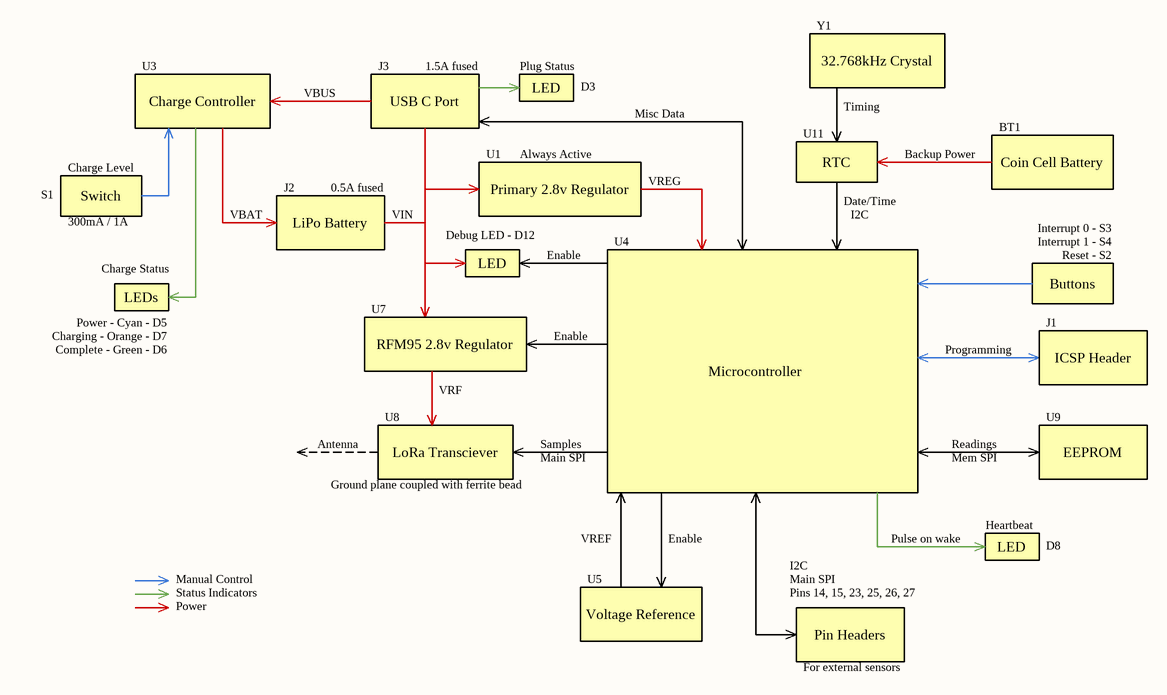
[diagram p2: blockd2-rev1-env.SchDoc]

### Notes on the sheet
- U3
- J3
- 1.5A fused
- Plug Status
- LED
- Y1
- 32.768kHz Crystal
- Charge Controller
- VBUS
- USB C Port
- D3
- Misc Data
- U11
- Timing
- BT1
- S1
- Charge Level
- Switch
- VBAT
- J2
- LiPo Battery
- 0.5A fused
- VIN
- U1
- Always Active
- Primary 2.8v Regulator
- VREG
- RTC
- Date/Time
- I2C
- Backup Power
- Coin Cell Battery
- 300mA / 1A
- Charge Status
- Debug LED - D12
- Enable
- U4
- Buttons
- Interrupt 0 - S3
- Interrupt 1 - S4
- Reset - S2
- LEDs
- Power - Cyan - D5
- Charging - Orange - D7
- Complete - Green - D6
- U7
- RFM95 2.8v Regulator
- Programming
- J1
- ICSP Header
- VRF
- Microcontroller
- Antenna
- Ground plane coupled with ferrite bead
- U8
- LoRa Transciever
- Samples
- Main SPI
- Readings
- Mem SPI
- U9
- EEPROM
- VREF
- Pulse on wake
- Heartbeat
- D8
- Manual Control
- Status Indicators
- Power
- U5
- Voltage Reference
- Pins 14, 15, 23, 25, 26, 27
- For external sensors
- Pin Headers

## Sheet stated-rev1-env.SchDoc
size A4; SheetNumber: 3; SheetTotal: 4
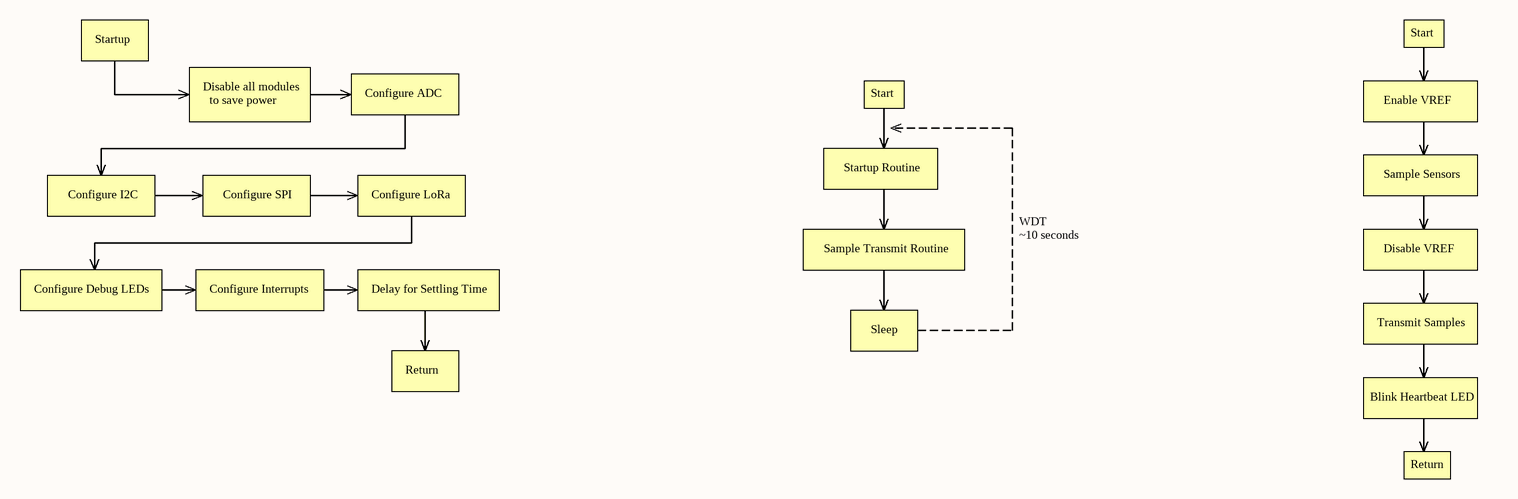
[diagram p3: stated-rev1-env.SchDoc]

### Notes on the sheet
- Startup
- Start
- Disable all modules
- to save power
- Configure ADC
- Enable VREF
- Configure I2C
- Configure SPI
- Configure LoRa
- Startup Routine
- Sample Sensors
- Sample Transmit Routine
- WDT
- ~10 seconds
- Disable VREF
- Configure Debug LEDs
- Configure Interrupts
- Delay for Settling Time
- Sleep
- Transmit Samples
- Return
- Blink Heartbeat LED

## Sheet blockd-rev1-env.SchDoc: Block Diagram
size A4; Date: 02/24/22; Author: Edward Kneller; SheetNumber: 2; SheetTotal: 2
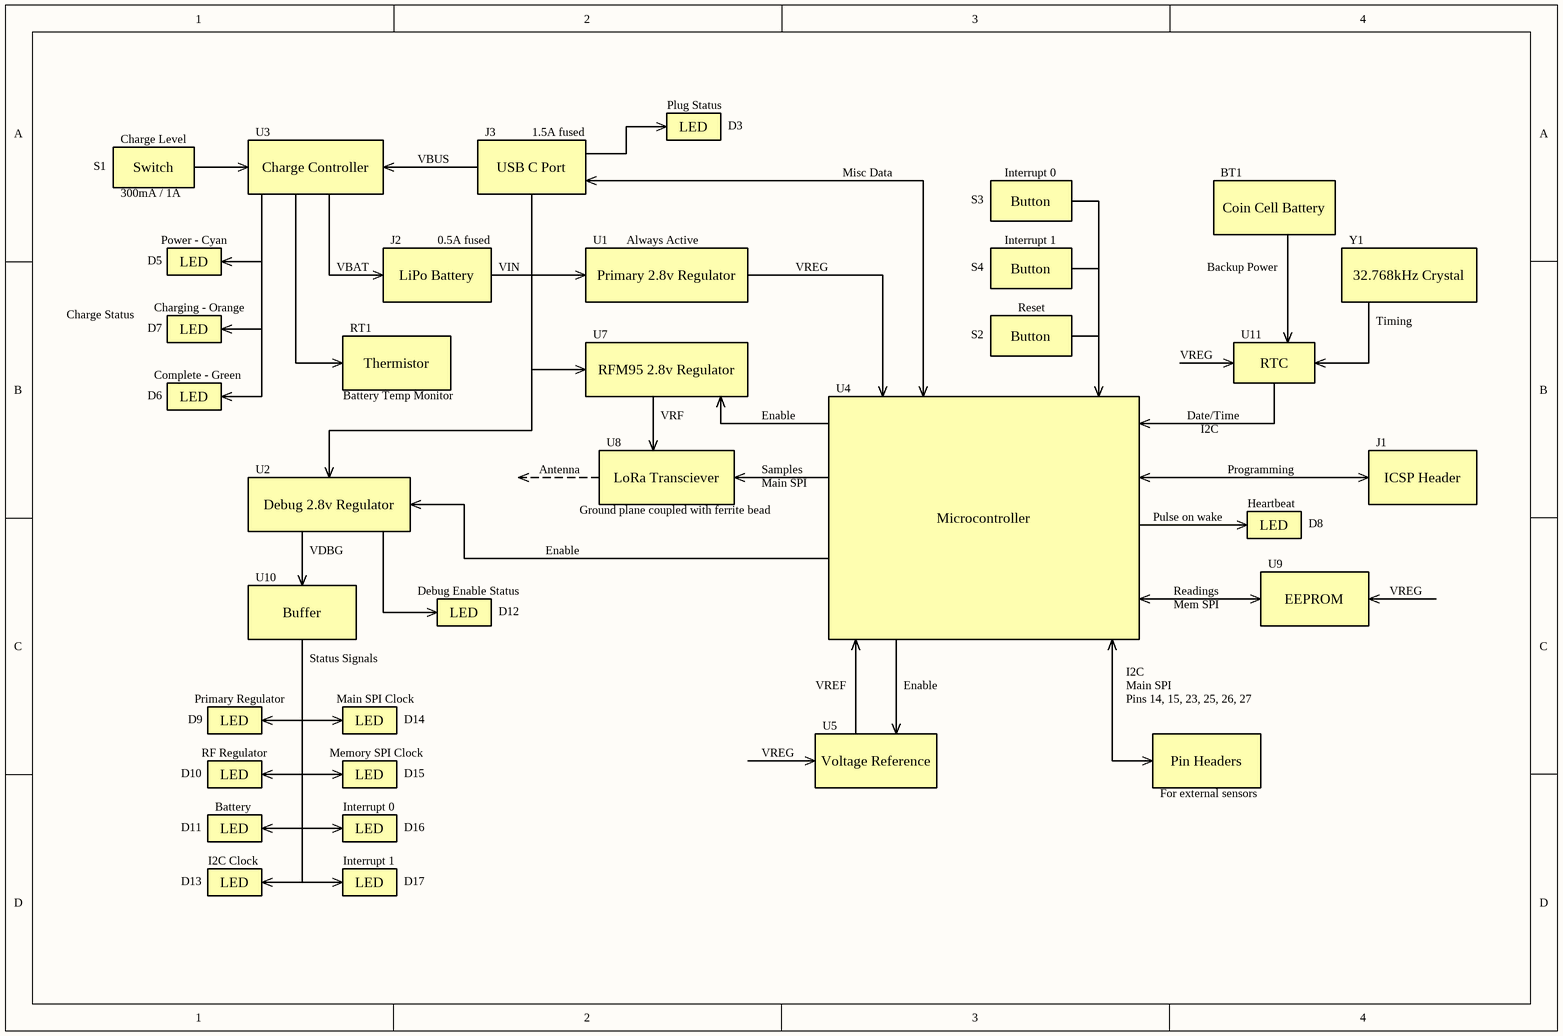
[diagram p4: blockd-rev1-env.SchDoc]

### Notes on the sheet
- Plug Status
- S1
- Charge Level
- Switch
- U3
- Charge Controller
- VBUS
- J3
- USB C Port
- 1.5A fused
- LED
- D3
- Misc Data
- Interrupt 0
- BT1
- 300mA / 1A
- Power - Cyan
- J2
- 0.5A fused
- U1
- Always Active
- S3
- Interrupt 1
- Button
- Coin Cell Battery
- Y1
- D5
- Charging - Orange
- VBAT
- LiPo Battery
- VIN
- Primary 2.8v Regulator
- VREG
- S4
- Reset
- Backup Power
- 32.768kHz Crystal
- Charge Status
- D7
- Complete - Green
- RT1
- Thermistor
- U7
- RFM95 2.8v Regulator
- S2
- U11
- RTC
- Timing
- D6
- Battery Temp Monitor
- U8
- VRF
- Enable
- U4
- Date/Time
- I2C
- J1
- U2
- Debug 2.8v Regulator
- Antenna
- Ground plane coupled with ferrite bead
- LoRa Transciever
- Samples
- Main SPI
- Microcontroller
- Pulse on wake
- Programming
- Heartbeat
- ICSP Header
- U10
- VDBG
- U9
- D8
- Buffer
- Debug Enable Status
- D12
- Readings
- Mem SPI
- EEPROM
- Primary Regulator
- Status Signals
- Main SPI Clock
- VREF
- Pins 14, 15, 23, 25, 26, 27
- D10
- D9
- RF Regulator
- Memory SPI Clock
- D14
- D15
- U5
- Voltage Reference
- Pin Headers
- D11
- Battery
- D16
- For external sensors
- D13
- I2C Clock
- D17